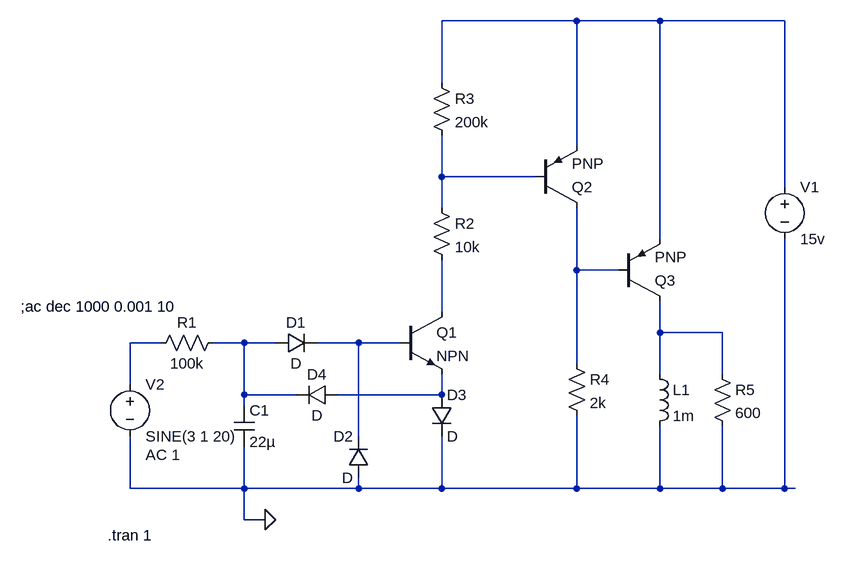
[diagram p0: schematic proteccion rele.asc]
proteccion rele.asc, the LTspice schematic file:
Version 4
SHEET 1 880 680
WIRE 384 -528 176 -528
WIRE 512 -528 384 -528
WIRE 704 -528 512 -528
WIRE 176 -432 176 -528
WIRE 384 -336 384 -528
WIRE 176 -288 176 -352
WIRE 320 -288 176 -288
WIRE 704 -272 704 -528
WIRE 176 -240 176 -288
WIRE 512 -192 512 -528
WIRE 384 -144 384 -240
WIRE 448 -144 384 -144
WIRE 176 -80 176 -160
WIRE 512 -48 512 -96
WIRE 608 -48 512 -48
WIRE -256 -32 -304 -32
WIRE -128 -32 -176 -32
WIRE -80 -32 -128 -32
WIRE 48 -32 -16 -32
WIRE 112 -32 48 -32
WIRE 384 0 384 -144
WIRE 512 16 512 -48
WIRE 608 16 608 -48
WIRE -304 32 -304 -32
WIRE -128 48 -128 -32
WIRE -48 48 -128 48
WIRE 176 48 176 16
WIRE 176 48 16 48
WIRE -128 64 -128 48
WIRE 48 112 48 -32
WIRE -304 192 -304 112
WIRE -128 192 -128 128
WIRE -128 192 -304 192
WIRE 48 192 48 176
WIRE 48 192 -128 192
WIRE 176 192 176 112
WIRE 176 192 48 192
WIRE 384 192 384 80
WIRE 384 192 176 192
WIRE 512 192 512 96
WIRE 512 192 384 192
WIRE 608 192 608 96
WIRE 608 192 512 192
WIRE 704 192 704 -192
WIRE 704 192 608 192
WIRE 720 192 704 192
WIRE -128 240 -128 192
WIRE -96 240 -128 240
FLAG -96 240 0
SYMBOL res -272 -16 R270
WINDOW 0 32 56 VTop 2
WINDOW 3 0 56 VBottom 2
SYMATTR InstName R1
SYMATTR Value 100k
SYMBOL diode -80 -16 R270
WINDOW 0 32 32 VTop 2
WINDOW 3 0 32 VBottom 2
SYMATTR InstName D1
SYMBOL diode 64 176 R180
WINDOW 0 24 64 Left 2
WINDOW 3 24 0 Left 2
SYMATTR InstName D2
SYMBOL cap -144 64 R0
SYMATTR InstName C1
SYMATTR Value 22µ
SYMBOL diode 160 48 R0
SYMATTR InstName D3
SYMBOL npn 112 -80 R0
SYMATTR InstName Q1
SYMBOL res 160 -256 R0
SYMATTR InstName R2
SYMATTR Value 10k
SYMBOL res 160 -448 R0
SYMATTR InstName R3
SYMATTR Value 200k
SYMBOL pnp 320 -240 M180
SYMATTR InstName Q2
SYMBOL pnp 448 -96 M180
SYMATTR InstName Q3
SYMBOL res 368 -16 R0
SYMATTR InstName R4
SYMATTR Value 2k
SYMBOL voltage 704 -288 R0
WINDOW 123 0 0 Left 0
WINDOW 39 0 0 Left 0
SYMATTR InstName V1
SYMATTR Value 15v
SYMBOL ind 496 0 R0
SYMATTR InstName L1
SYMATTR Value 1m
SYMBOL res 592 0 R0
SYMATTR InstName R5
SYMATTR Value 600
SYMBOL voltage -304 16 R0
WINDOW 123 24 124 Left 2
WINDOW 39 0 0 Left 0
SYMATTR InstName V2
SYMATTR Value SINE(3 1 20)
SYMATTR Value2 AC 1
SYMBOL diode 16 32 R90
WINDOW 0 0 32 VBottom 2
WINDOW 3 32 32 VTop 2
SYMATTR InstName D4
TEXT -338 264 Left 2 !.tran 1
TEXT -472 -88 Left 2 !;ac dec 1000 0.001 10

The netlist it stands for:
* proteccion rele.asc
R1 N006 N007 100k
D1 N007 N008 D
D2 0 N008 D
C1 N007 0 22µ
D3 N009 0 D
Q1 N004 N008 N009 0 NPN
R2 N002 N004 10k
R3 N001 N002 200k
Q2 N003 N002 N001 0 PNP
Q3 N005 N003 N001 0 PNP
R4 N003 0 2k
V1 N001 0 15v
L1 N005 0 1m
R5 N005 0 600
V2 N006 0 SINE(3 1 20) AC 1
D4 N009 N007 D
.model D D
.lib standard.dio
.model NPN NPN
.model PNP PNP
.lib standard.bjt
.tran 1
;ac dec 1000 0.001 10
.backanno
.end